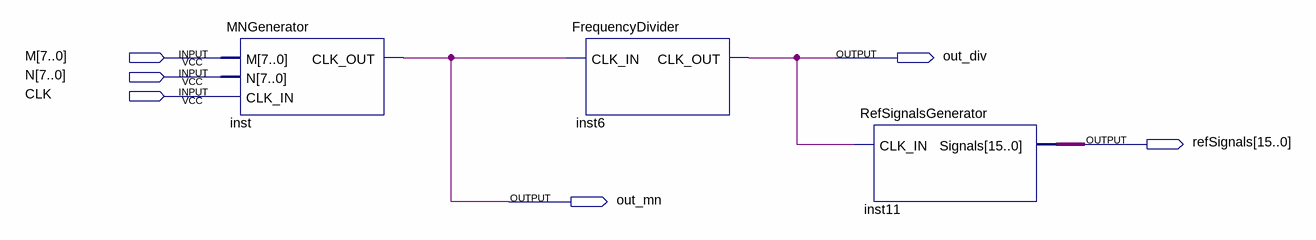
[diagram p0: schematic sheet]
// Quartus schematic LABv2.bdf as structural Verilog: 3 symbols, 6 pins
module LABv2 (
  input  [7:0] M,
  input  [7:0] N,
  input  CLK,
  output out_div,
  output [15:0] refSignals,
  output out_mn
);

  MNGenerator inst (.M(M), .N(N), .CLK_IN(CLK), .CLK_OUT(out_mn));
  FrequencyDivider inst6 (.CLK_IN(out_mn), .CLK_OUT(out_div));
  RefSignalsGenerator inst11 (.CLK_IN(out_div), .Signals(refSignals));
endmodule
